# Altium schematic sheet ADC.SchDoc: Блок цифровой
size 420 x 297 mm; ApprovedBy: Лысак; CheckedBy: Богданов; Author: Пятиренко; CompanyName: нпг; DrawnBy: Человек; Organization: айцайц; DocumentNumber: АЕСН.466369.100Э3; SheetNumber: 1; SheetTotal: 7; PERVICH PRIM: АЕСН.466369.100; Title2: Схема электрическая принципиальная; DocumentName: Sheet1.SCHDOC; Application_BuildNumber: sdfsdfsdfsdfsdfs
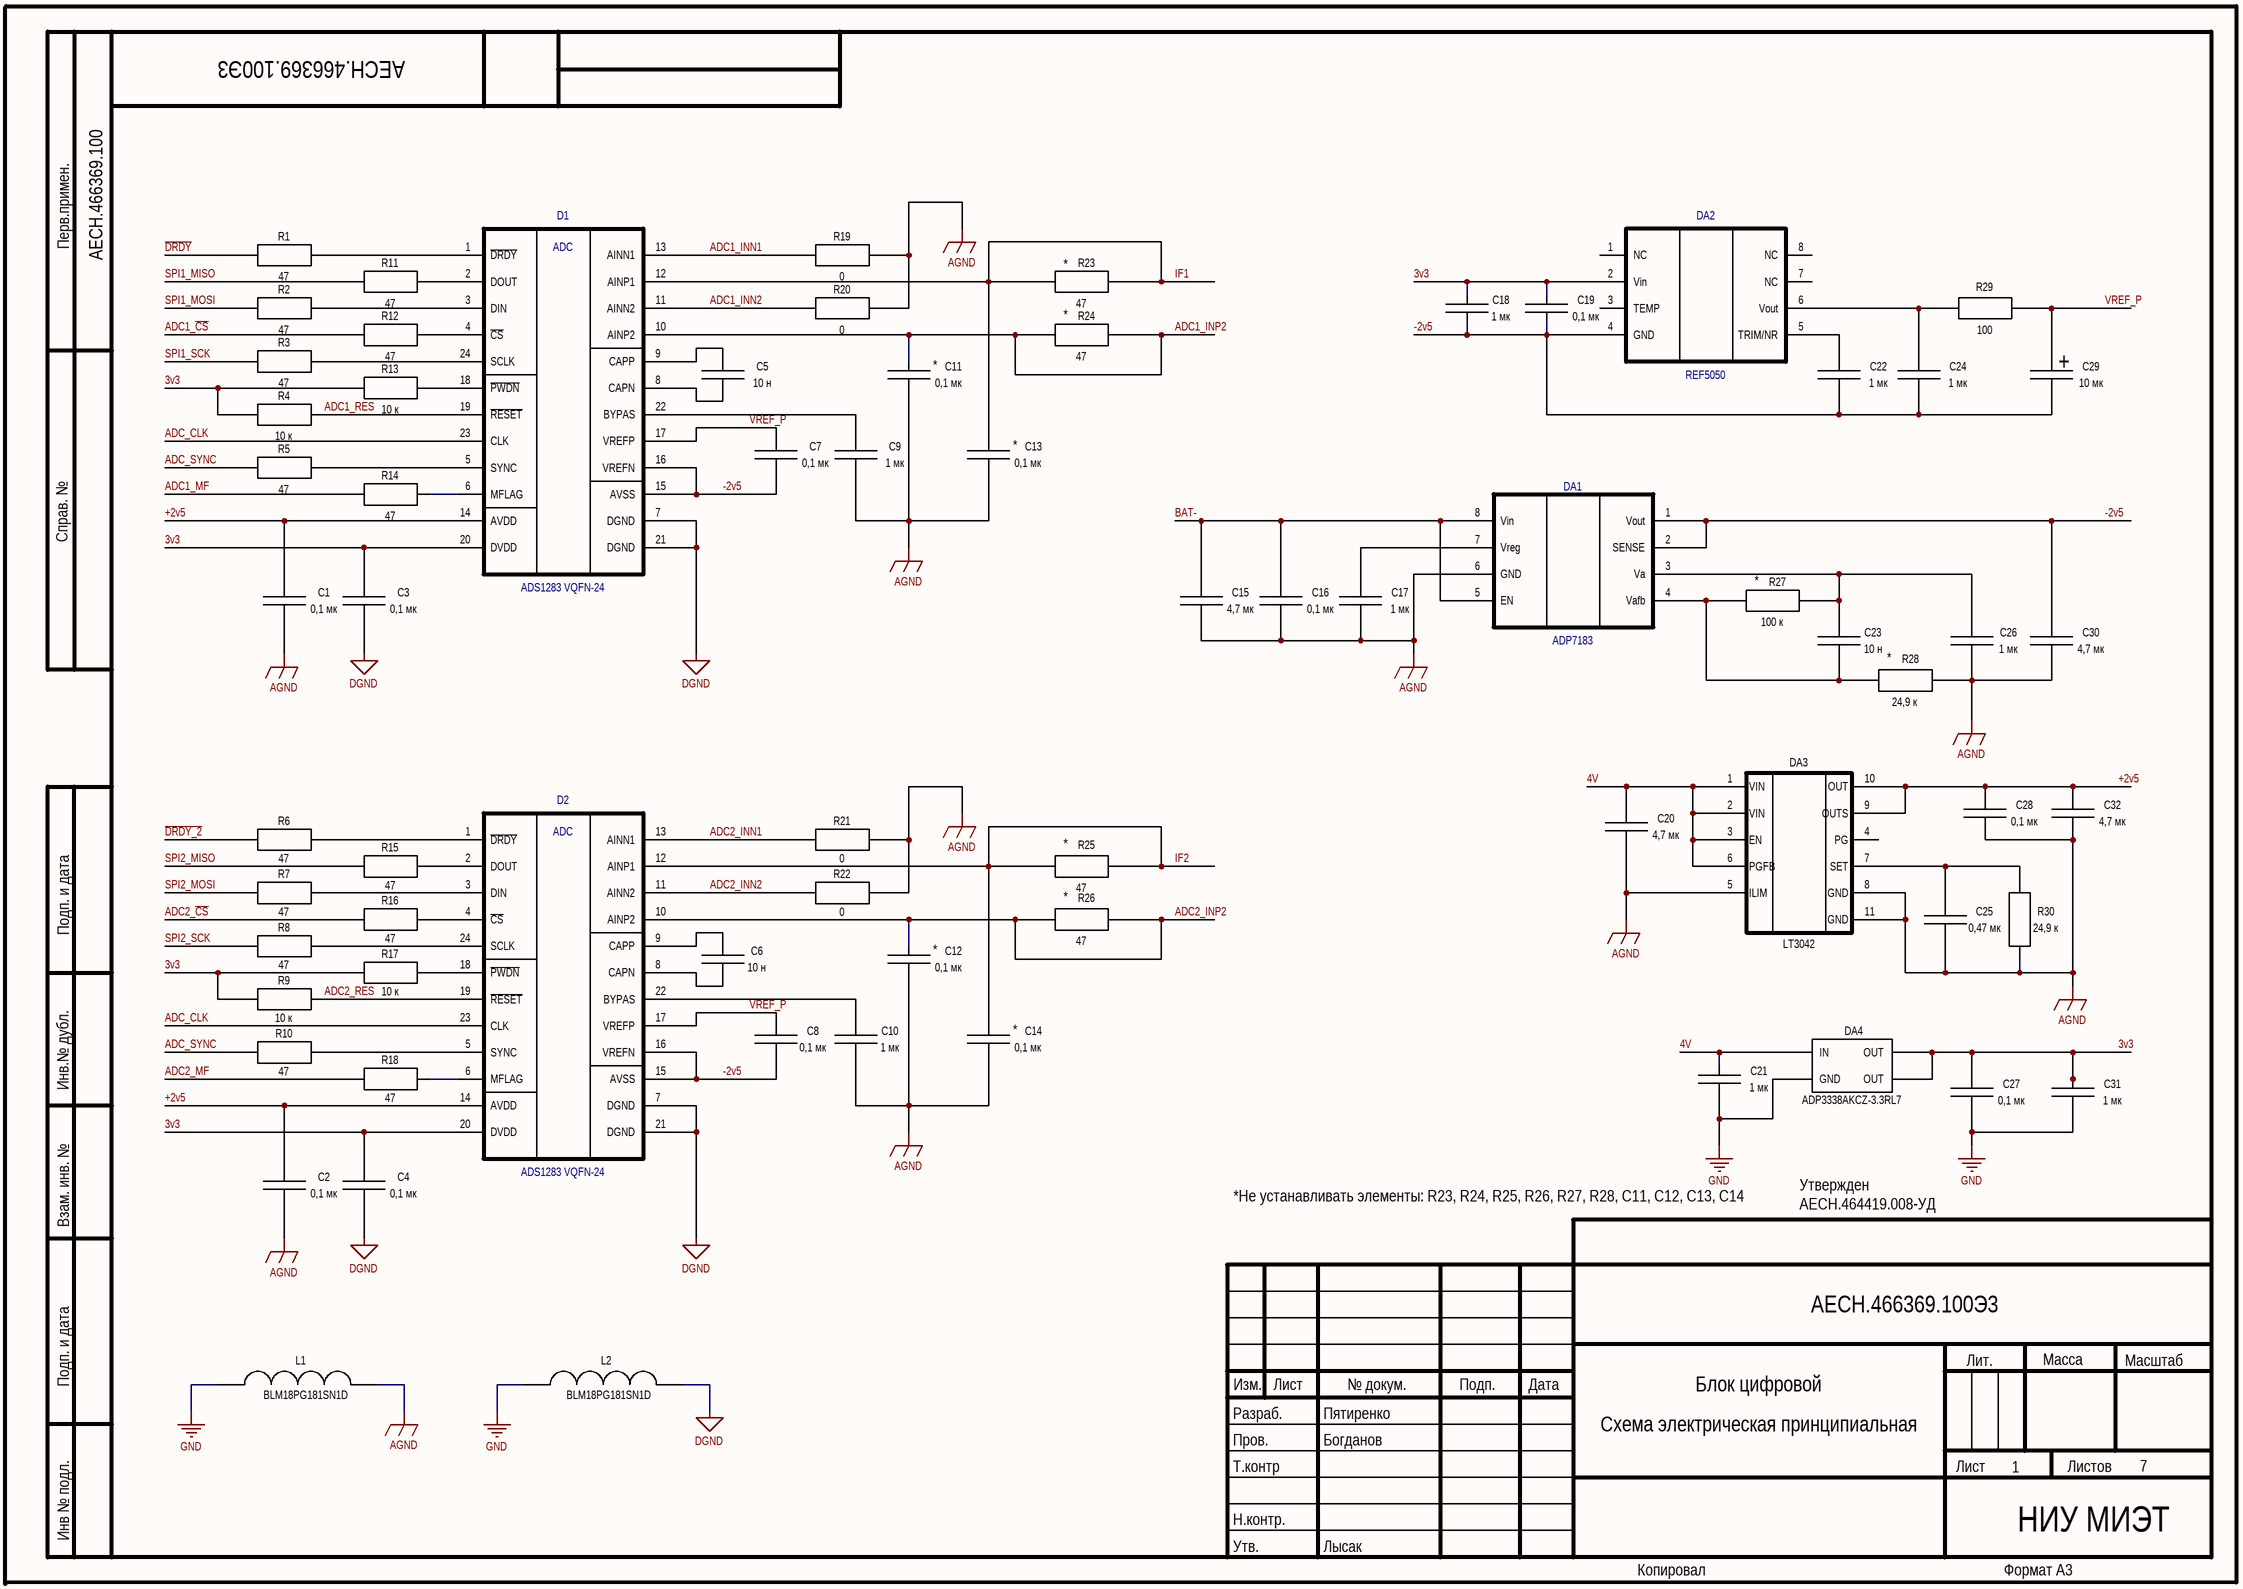
[diagram p0: ADC.SchDoc]

## Parts
C1  value 0,1 мк  [C0603]  (hidden comment: C)
C2  value 0,1 мк  [C0603]  (hidden comment: C)
C3  value 0,1 мк  [C0603]  (hidden comment: C)
C4  value 0,1 мк  [C0603]  (hidden comment: C)
C5  value 10 н  [C0603]  (hidden comment: C)
C6  value 10 н  [C0603]  (hidden comment: C)
C7  value 0,1 мк  [C0603]  (hidden comment: C)
C8  value 0,1 мк  [C0603]  (hidden comment: C)
C9  value 1 мк  [C0603]  (hidden comment: C)
C10  value 1 мк  [C0603]  (hidden comment: C)
C11  value 0,1 мк  [C0603]  (hidden comment: C)
C12  value 0,1 мк  [C0603]  (hidden comment: C)
C13  value 0,1 мк  [C0603]  (hidden comment: C)
C14  value 0,1 мк  [C0603]  (hidden comment: C)
C15  value 4,7 мк  [C0603]  (hidden comment: C)
C16  value 0,1 мк  [C0603]  (hidden comment: C)
C17  value 1 мк  [C0603]  (hidden comment: C)
C18  value 1 мк  [C0603]  (hidden comment: C)
C19  value 0,1 мк  [C0603]  (hidden comment: C)
C20  value 4,7 мк  [C0603]  (hidden comment: C)
C21  value 1 мк  [C0603]  (hidden comment: C)
C22  value 1 мк  [C0603]  (hidden comment: C)
C23  value 10 н  [C0603]  (hidden comment: C)
C24  value 1 мк  [C0603]  (hidden comment: C)
C25  value 0,47 мк  [C0603]  (hidden comment: C)
C26  value 1 мк  [C0603]  (hidden comment: C)
C27  value 0,1 мк  [C0603]  (hidden comment: C)
C28  value 0,1 мк  [C0603]  (hidden comment: C)
C29  value 10 мк  [Case A]  (hidden comment: C_el)
C30  value 4,7 мк  [C0603]  (hidden comment: C)
C31  value 1 мк  [C0603]  (hidden comment: C)
C32  value 4,7 мк  [C0603]  (hidden comment: C)
D1  ADS1283 VQFN-24  [VQFN24_8x8x4x4]
D2  ADS1283 VQFN-24  [VQFN24_8x8x4x4]
DA1  ADP7183  [LFCSP-8]
DA2  REF5050  [SOIC8]
DA3  LT3042  [DFN-10 3x3]
DA4  ADP3338AKCZ-3.3RL7  [SOT-223]
L1  BLM18PG181SN1D  [INDC_0603]
L2  BLM18PG181SN1D  [INDC_0603]
R1  value 47  [R0603]  (hidden comment: R)
R2  value 47  [R0603]  (hidden comment: R)
R3  value 47  [R0603]  (hidden comment: R)
R4  value 10 к  [R0603]  (hidden comment: R)
R5  value 47  [R0603]  (hidden comment: R)
R6  value 47  [R0603]  (hidden comment: R)
R7  value 47  [R0603]  (hidden comment: R)
R8  value 47  [R0603]  (hidden comment: R)
R9  value 10 к  [R0603]  (hidden comment: R)
R10  value 47  [R0603]  (hidden comment: R)
R11  value 47  [R0603]  (hidden comment: R)
R12  value 47  [R0603]  (hidden comment: R)
R13  value 10 к  [R0603]  (hidden comment: R)
R14  value 47  [R0603]  (hidden comment: R)
R15  value 47  [R0603]  (hidden comment: R)
R16  value 47  [R0603]  (hidden comment: R)
R17  value 10 к  [R0603]  (hidden comment: R)
R18  value 47  [R0603]  (hidden comment: R)
R19  value 0  [R0603]  (hidden comment: R)
R20  value 0  [R0603]  (hidden comment: R)
R21  value 0  [R0603]  (hidden comment: R)
R22  value 0  [R0603]  (hidden comment: R)
R23  value 47  [R0603]  (hidden comment: R)
R24  value 47  [R0603]  (hidden comment: R)
R25  value 47  [R0603]  (hidden comment: R)
R26  value 47  [R0603]  (hidden comment: R)
R27  value 100 к  [R0603]  (hidden comment: R)
R28  value 24,9 к  [R0603]  (hidden comment: R)
R29  value 100  [R0603]  (hidden comment: R)
R30  value 24,9 к  [R0603]  (hidden comment: R)

## Nets
AGND: C1.2 C2.2 C9.2 C10.2 C11.2 C12.2 C13.2 C14.2 C15.2 C16.2 C17.2 C20.2 C25.2 C26.2 C28.2 C30.2 C32.2 DA1.6(GND) DA3.5(ILIM) DA3.8(GND) DA3.11(GND) L1.1 R19.2 R20.2 R21.2 R22.2 R28.2 R30.1
DGND: C3.2 C4.2 D1.7(DGND) D1.21(DGND) D2.7(DGND) D2.21(DGND) L2.1
GND: C21.2 C27.2 C31.2 DA4.1(GND) L1.2 L2.2
3v3: C3.1 C4.1 C18.1 C19.1 C27.1 C31.1 D1.20(DVDD) D2.20(DVDD) DA2.2(Vin) DA4.2(OUT) DA4.4(OUT) R4.1 R9.1 R13.1 R17.1
4V: C20.1 C21.1 DA3.1(VIN) DA3.2(VIN) DA3.3(EN) DA3.6(PGFB) DA4.3(IN)
+2v5: C1.1 C2.1 C28.1 C32.1 D1.14(AVDD) D2.14(AVDD) DA3.9(OUTS) DA3.10(OUT)
-2v5: C7.2 C8.2 C18.2 C19.2 C22.2 C24.2 C29.2 C30.1 D1.15(AVSS) D1.16(VREFN) D2.15(AVSS) D2.16(VREFN) DA1.1(Vout) DA1.2(SENSE) DA2.4(GND)
ADC1_~{CS}: R12.1
ADC1_INN1: D1.13(AINN1) R19.1
ADC1_INN2: D1.11(AINN2) R20.1
ADC1_INP2: C11.1 D1.10(AINP2) R24.1 R24.2
ADC1_MF: R14.1
ADC1_RES: D1.19(~{RESET}) R4.2
ADC2_~{CS}: R16.1
ADC2_INN1: D2.13(AINN1) R21.1
ADC2_INN2: D2.11(AINN2) R22.1
ADC2_INP2: C12.1 D2.10(AINP2) R26.1 R26.2
ADC2_MF: R18.1
ADC2_RES: D2.19(~{RESET}) R9.2
ADC_CLK: D1.23(CLK) D2.23(CLK)
ADC_SYNC: R5.1 R10.1
BAT-: C15.1 C16.1 DA1.5(EN) DA1.8(Vin)
~{DRDY}: R1.1
~{DRDY_2}: R6.1
IF1: C13.1 D1.12(AINP1) R23.1 R23.2
IF2: C14.1 D2.12(AINP1) R25.1 R25.2
SPI1_MISO: R11.1
SPI1_MOSI: R2.1
SPI1_SCK: R3.1
SPI2_MISO: R15.1
SPI2_MOSI: R7.1
SPI2_SCK: R8.1
VREF_P: C7.1 C8.1 C29.1 D1.17(VREFP) D2.17(VREFP) R29.2
NetC5_1: C5.1 D1.8(CAPN)
NetC5_2: C5.2 D1.9(CAPP)
NetC6_1: C6.1 D2.8(CAPN)
NetC6_2: C6.2 D2.9(CAPP)
NetC9_1: C9.1 D1.22(BYPAS)
NetC10_1: C10.1 D2.22(BYPAS)
NetC17_1: C17.1 DA1.7(Vreg)
NetC22_1: C22.1 DA2.5(TRIM/NR)
NetC23_1: C23.1 DA1.4(Vafb) R27.1 R28.1
NetC23_2: C23.2 C26.1 DA1.3(Va) R27.2
NetC24_1: C24.1 DA2.6(Vout) R29.1
NetC25_1: C25.1 DA3.7(SET) R30.2
NetD1_1: D1.1(~{DRDY}) R1.2
NetD1_2: D1.2(DOUT) R11.2
NetD1_3: D1.3(DIN) R2.2
NetD1_4: D1.4(~{CS}) R12.2
NetD1_5: D1.5(SYNC) R5.2
NetD1_6: D1.6(MFLAG) R14.2
NetD1_18: D1.18(~{PWDN}) R13.2
NetD1_24: D1.24(SCLK) R3.2
NetD2_1: D2.1(~{DRDY}) R6.2
NetD2_2: D2.2(DOUT) R15.2
NetD2_3: D2.3(DIN) R7.2
NetD2_4: D2.4(~{CS}) R16.2
NetD2_5: D2.5(SYNC) R10.2
NetD2_6: D2.6(MFLAG) R18.2
NetD2_18: D2.18(~{PWDN}) R17.2
NetD2_24: D2.24(SCLK) R8.2

Not connected (* = marked no-connect by the designer): DA2 1(NC) 3(TEMP) 7(NC) 8(NC); DA3 4(PG)

## Notes on the sheet
- (near R23) *
- (near R24) *
- (near C11) *
- (near C13) *
- (near R27) *
- (near R28) *
- (near R25) *
- *
- (near C12) *
- (near C14) *
- *Не устанавливать элементы: R23, R24, R25, R26, R27, R28, C11, C12, C13, C14
- Утвержден
- АЕСН.464419.008-УД
- НИУ МИЭТ
- Перв.примен.
- Справ. №
- Подп. и дата
- Инв.№ дубл.
- Взам. инв. №
- Изм.
- Лист
- № докум.
- Подп.
- Дата
- Лит.
- Масса
- Масштаб
- Пров.
- Т.контр
- Разраб.
- Листов
- Инв № подл.
- Н.контр.
- Утв.
- Копировал
- Формат А3
- (in symbol ADS1283) ADC
- (in symbol C_el) +

## Library data of the parts
C1-C4 C7 C8 C11-C14 C16 C19 C27 C28 = C: PartNumber: GRM188R71H104KA93D; Tolerance: ±10%; Voltage: 50 В; Dielectric: X7R; Case: 0603
  C1-C4 C7 C8 C16 C19 C27 C28: Mount: *
C5 C6 C23 = C: PartNumber: GRM188R72A103KA01J; Tolerance: ±10%; Voltage: 100В; Dielectric: X7R; Case: 0603; Mount: *
C9 C10 C17 C18 C21 C22 C24 C26 C31 = C: PartNumber: GRM188R71E105KA12D; Tolerance: ±10%; Voltage: 25 В; Dielectric: X7R; Case: 0603; Mount: *
C15 C20 C30 C32 = C: PartNumber: GRM188Z71C475KE21D; Tolerance: ±10%; Voltage: 16 В; Dielectric: X7R; Case: 0603; Mount: *
C25 = C: PartNumber: GRM188R71E474KA12D; Tolerance: ±10%; Voltage: 25 В; Dielectric: X7R; Case: 0603; Mount: *
C29 = C_el: PartNumber: TAJA106K016RNJ; Tolerance: ±10%; Voltage: 16 V; Dielectric: *; Case: "A"; Mount: *
D1 D2 = ADS1283: ADC 2ch
DA2 = REF50xx
DA4 = LD1117S33
L1 L2 = L_1
R1-R3 R5-R8 R10-R12 R14-R16 R18 R23-R26 = R: PartNumber: RC0603JR-0747RL; Tolerance: ±5%; Power: 0.1 Вт; Case: 0603
R4 R9 R13 R17 = R: PartNumber: RC0603JR-0710KL; Tolerance: ±5%; Power: 0.1 Вт; Case: 0603
R19-R22 = R: PartNumber: RC0603JR-070RL; Tolerance: ±5%; Power: 0.1 Вт; Case: 0603
R27 = R: PartNumber: RC0603FR-07100KL; Tolerance: ±1%; Power: 0.1 Вт; Case: 0603
R28 R30 = R: PartNumber: RC0603FR-0724K9L; Tolerance: ±1%; Power: 0.1 Вт; Case: 0603
R29 = R: PartNumber: RC0603JR-07100RL; Tolerance: ±5%; Power: 0.1 Вт; Case: 0603